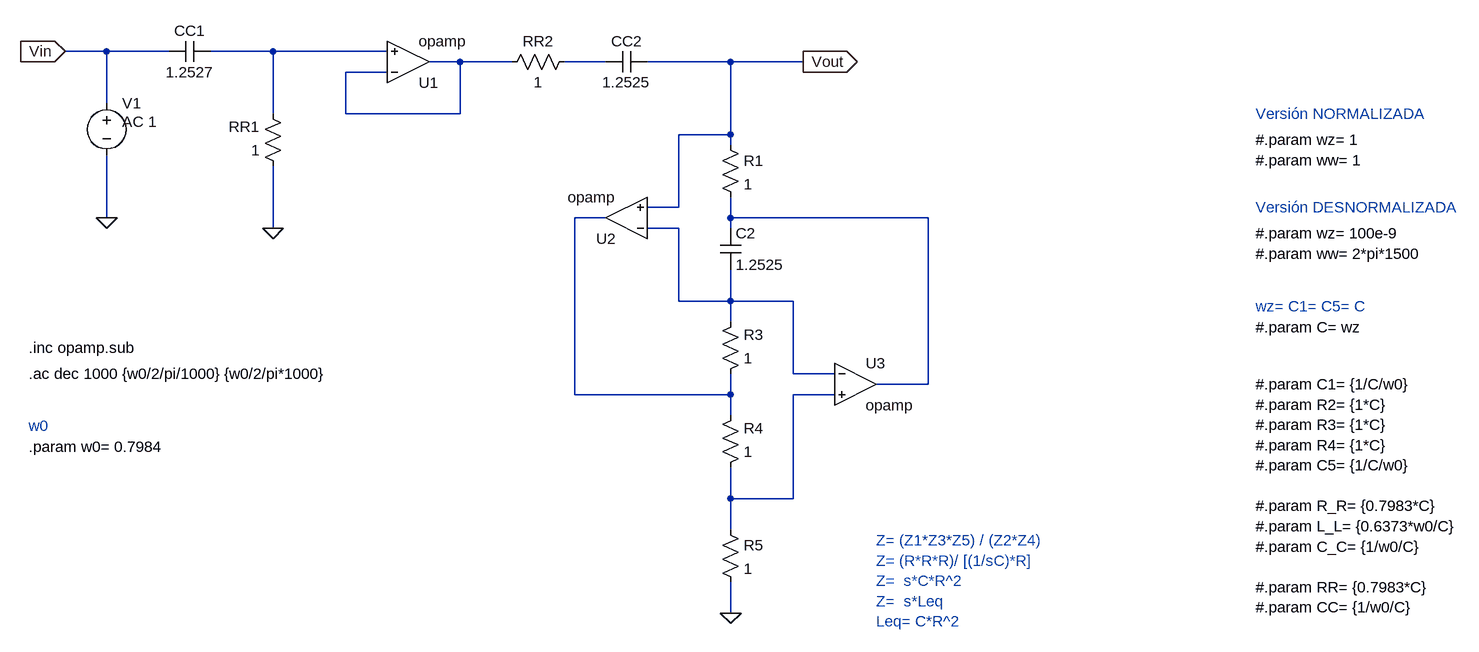
[diagram p0: schematic TS4_LTSpice_Girador.asc]
TS4_LTSpice_Girador.asc, the LTspice schematic file:
Version 4
SHEET 1 2464 1004
WIRE -864 -208 -928 -208
WIRE -768 -208 -864 -208
WIRE -608 -208 -704 -208
WIRE -432 -208 -608 -208
WIRE -320 -192 -368 -192
WIRE -240 -192 -320 -192
WIRE -96 -192 -160 -192
WIRE 96 -192 -32 -192
WIRE 208 -192 96 -192
WIRE -432 -176 -496 -176
WIRE -864 -128 -864 -208
WIRE -608 -112 -608 -208
WIRE -496 -112 -496 -176
WIRE -320 -112 -320 -192
WIRE -320 -112 -496 -112
WIRE 96 -80 96 -192
WIRE 96 -80 16 -80
WIRE 96 -64 96 -80
WIRE 16 32 16 -80
WIRE 16 32 -32 32
WIRE -864 48 -864 -48
WIRE -96 48 -144 48
WIRE 96 48 96 16
WIRE 400 48 96 48
WIRE -608 64 -608 -32
WIRE 16 64 -32 64
WIRE 96 64 96 48
WIRE 16 176 16 64
WIRE 96 176 96 128
WIRE 96 176 16 176
WIRE 192 176 96 176
WIRE 96 208 96 176
WIRE 192 288 192 176
WIRE 256 288 192 288
WIRE 400 304 400 48
WIRE 400 304 320 304
WIRE -144 320 -144 48
WIRE 96 320 96 288
WIRE 96 320 -144 320
WIRE 256 320 192 320
WIRE 96 352 96 320
WIRE 96 480 96 432
WIRE 192 480 192 320
WIRE 192 480 96 480
WIRE 96 528 96 480
WIRE 96 656 96 608
FLAG -928 -208 Vin
IOPIN -928 -208 In
FLAG 208 -192 Vout
IOPIN 208 -192 Out
FLAG -864 48 0
FLAG 96 656 0
FLAG -608 64 0
SYMBOL Opamps\\opamp -64 112 R180
SYMATTR InstName U2
SYMBOL Opamps\\opamp 288 240 R0
SYMATTR InstName U3
SYMBOL res 80 304 M180
WINDOW 0 36 76 Left 2
WINDOW 3 36 40 Left 2
SYMATTR InstName R3
SYMATTR Value 1
SYMBOL res 80 448 M180
WINDOW 0 36 76 Left 2
WINDOW 3 36 40 Left 2
SYMATTR InstName R4
SYMATTR Value 1
SYMBOL cap -704 -224 R90
WINDOW 0 0 32 VBottom 2
WINDOW 3 32 32 VTop 2
SYMATTR InstName CC1
SYMATTR Value 1.2527
SYMBOL res -592 -16 R180
WINDOW 0 36 76 Left 2
WINDOW 3 36 40 Left 2
SYMATTR InstName RR1
SYMATTR Value 1
SYMBOL Opamps\\opamp -400 -128 M180
SYMATTR InstName U1
SYMBOL res -144 -208 R90
WINDOW 0 0 56 VBottom 2
WINDOW 3 32 56 VTop 2
SYMATTR InstName RR2
SYMATTR Value 1
SYMBOL cap -96 -176 R270
WINDOW 0 32 32 VTop 2
WINDOW 3 0 32 VBottom 2
SYMATTR InstName CC2
SYMATTR Value 1.2525
SYMBOL voltage -864 -144 R0
WINDOW 123 24 44 Left 2
WINDOW 39 0 0 Left 0
SYMATTR Value2 AC 1
SYMATTR InstName V1
SYMATTR Value ""
SYMBOL res 80 -80 R0
SYMATTR InstName R1
SYMATTR Value 1
SYMBOL res 80 512 R0
SYMATTR InstName R5
SYMATTR Value 1
SYMBOL cap 80 64 R0
SYMATTR InstName C2
SYMATTR Value 1.2525
TEXT -984 248 Left 2 !.inc opamp.sub
TEXT 320 544 Left 2 ;Z= (Z1*Z3*Z5) / (Z2*Z4)\nZ= (R*R*R)/ [(1/sC)*R]\nZ=  s*C*R^2\nZ=  s*Leq\nLeq= C*R^2
TEXT 904 -72 Left 2 !#.param wz= 1\n#.param ww= 1
TEXT 904 -112 Left 2 ;Versión NORMALIZADA
TEXT 904 32 Left 2 ;Versión DESNORMALIZADA
TEXT 904 72 Left 2 !#.param wz= 100e-9\n#.param ww= 2*pi*1500
TEXT -984 400 Left 2 !.param w0= 0.7984
TEXT 904 216 Left 2 !#.param C= wz
TEXT -984 368 Left 2 ;w0
TEXT 904 184 Left 2 ;wz= C1= C5= C
TEXT 904 304 Left 2 !#.param C1= {1/C/w0}\n#.param R2= {1*C}\n#.param R3= {1*C}\n#.param R4= {1*C}\n#.param C5= {1/C/w0}\n \n#.param R_R= {0.7983*C}\n#.param L_L= {0.6373*w0/C}\n#.param C_C= {1/w0/C}\n \n#.param RR= {0.7983*C}\n#.param CC= {1/w0/C}
TEXT -984 288 Left 2 !.ac dec 1000 {w0/2/pi/1000} {w0/2/pi*1000}

The netlist it stands for:
* TS4_LTSpice_Girador.asc
XU2 N006 Vout N004 opamp Aol=100K GBW=10Meg  ; pins invin noninvin out
XU3 N006 N007 N005 opamp Aol=100K GBW=10Meg  ; pins invin noninvin out
R3 N004 N006 1
R4 N007 N004 1
CC1 N001 Vin 1.2527
RR1 0 N001 1
XU1 N002 N001 N002 opamp Aol=100K GBW=10Meg  ; pins invin noninvin out
RR2 N003 N002 1
CC2 N003 Vout 1.2525
V1 Vin 0 AC 1
R1 Vout N005 1
R5 N007 0 1
C2 N005 N006 1.2525
.inc opamp.sub
* Z= (Z1*Z3*Z5) / (Z2*Z4)
* Z= (R*R*R)/ [(1/sC)*R]
* Z=  s*C*R^2
* Z=  s*Leq
* Leq= C*R^2
#.param wz= 1
#.param ww= 1
* Versión NORMALIZADA
* Versión DESNORMALIZADA
#.param wz= 100e-9
#.param ww= 2*pi*1500
.param w0= 0.7984
#.param C= wz
* w0
* wz= C1= C5= C
#.param C1= {1/C/w0}
#.param R2= {1*C}
#.param R3= {1*C}
#.param R4= {1*C}
#.param C5= {1/C/w0}
#.param R_R= {0.7983*C}
#.param L_L= {0.6373*w0/C}
#.param C_C= {1/w0/C}
#.param RR= {0.7983*C}
#.param CC= {1/w0/C}
.ac dec 1000 {w0/2/pi/1000} {w0/2/pi*1000}
.backanno
.end